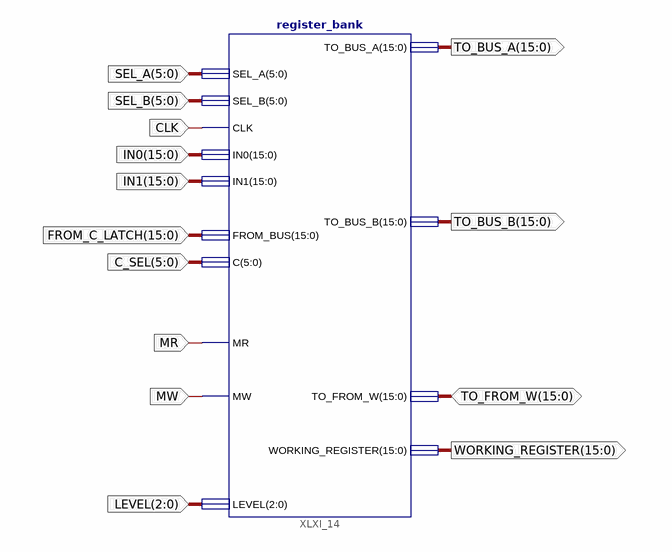
[diagram p0: schematic sheet 1]
// Xilinx ISE schematic register_bank_easy.sch (artix7) as structural Verilog: 1 symbols, 14 ports
module register_bank_easy (
  input  [5:0] SEL_A,
  input  [5:0] SEL_B,
  input  [5:0] C_SEL,
  input  CLK,
  input  [15:0] IN0,
  input  [15:0] IN1,
  input  [15:0] FROM_C_LATCH,
  input  MR,
  input  MW,
  input  [2:0] LEVEL,
  inout  [15:0] TO_FROM_W,
  output [15:0] TO_BUS_A,
  output [15:0] TO_BUS_B,
  output [15:0] WORKING_REGISTER
);

  register_bank XLXI_14 (
    .SEL_A(SEL_A), .SEL_B(SEL_B), .CLK(CLK), .IN0(IN0), .IN1(IN1), .FROM_BUS(FROM_C_LATCH), .C(C_SEL),
    .MR(MR), .MW(MW), .LEVEL(LEVEL), .TO_FROM_W(TO_FROM_W), .TO_BUS_A(TO_BUS_A), .TO_BUS_B(TO_BUS_B),
    .WORKING_REGISTER(WORKING_REGISTER));
endmodule
